# Altium schematic sheet Muller-C1(2).SchDoc
size 429 x 344 mm
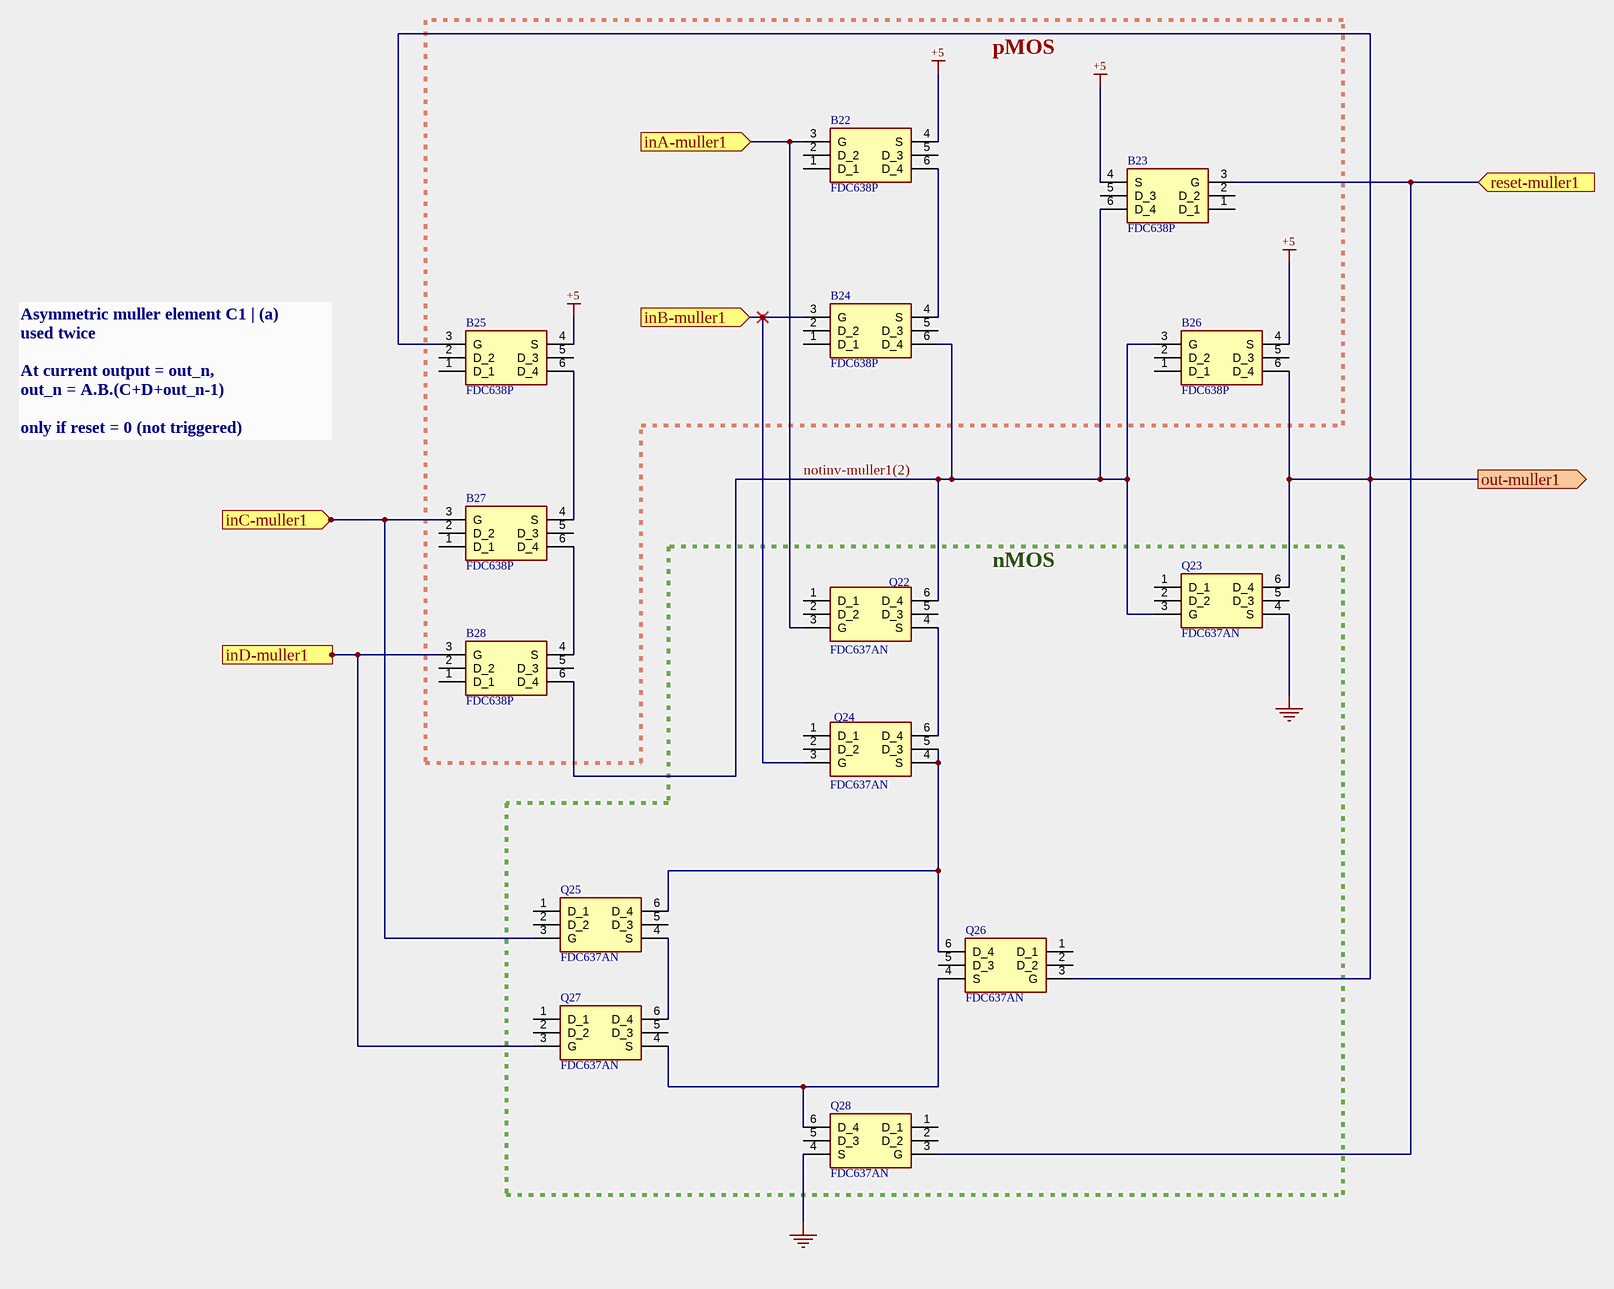
[diagram p0: Muller-C1(2).SchDoc]

## Parts
B22  FDC638P  [SOT95P275X110-6N]
B23  FDC638P  [SOT95P275X110-6N]
B24  FDC638P  [SOT95P275X110-6N]
B25  FDC638P  [SOT95P275X110-6N]
B26  FDC638P  [SOT95P275X110-6N]
B27  FDC638P  [SOT95P275X110-6N]
B28  FDC638P  [SOT95P275X110-6N]
Q22  FDC637AN  [SOT95P275X110-6N]
Q23  FDC637AN  [SOT95P275X110-6N]
Q24  FDC637AN  [SOT95P275X110-6N]
Q25  FDC637AN  [SOT95P275X110-6N]
Q26  FDC637AN  [SOT95P275X110-6N]
Q27  FDC637AN  [SOT95P275X110-6N]
Q28  FDC637AN  [SOT95P275X110-6N]

## Blocks framed on the sheet
pMOS: B22-B28
nMOS: Q22-Q28

## Ports
inA-muller1 (in), inB-muller1 (in), inC-muller1 (in), inD-muller1 (in), out-muller1 (out), reset-muller1 (in)

## Nets
+5: B22.4(S) B23.4(S) B25.4(S) B26.4(S)
GND: Q23.4(S) Q28.4(S)
inA-muller1: B22.3(G) Q22.3(G) ; port inA-muller1
inB-muller1: B24.3(G) Q24.3(G) ; port inB-muller1
inC-muller1: B27.3(G) Q25.3(G) ; port inC-muller1
inD-muller1: B28.3(G) Q27.3(G) ; port inD-muller1
notinv-muller1(2): B23.6(D_4) B24.6(D_4) B26.3(G) B28.6(D_4) Q22.6(D_4) Q23.3(G)
out-muller1: B25.3(G) B26.6(D_4) Q23.6(D_4) Q26.3(G) ; port out-muller1
reset-muller1: B23.3(G) Q28.3(G) ; port reset-muller1
NetB22_6: B22.6(D_4) B24.4(S)
NetB25_6: B25.6(D_4) B27.4(S)
NetB27_6: B27.6(D_4) B28.4(S)
NetQ22_4: Q22.4(S) Q24.6(D_4)
NetQ24_4: Q24.4(S) Q24.5(D_3) Q25.6(D_4) Q26.6(D_4)
NetQ25_4: Q25.4(S) Q27.6(D_4)
NetQ26_4: Q26.4(S) Q27.4(S) Q28.6(D_4)

Not connected (* = marked no-connect by the designer): B22 1(D_1) 2(D_2) 5(D_3); B23 1(D_1) 2(D_2) 5(D_3); B24 1(D_1) 2(D_2) 5(D_3); B25 1(D_1) 2(D_2) 5(D_3); B26 1(D_1) 2(D_2) 5(D_3); B27 1(D_1) 2(D_2) 5(D_3); B28 1(D_1) 2(D_2) 5(D_3); Q22 1(D_1) 2(D_2) 5(D_3); Q23 1(D_1) 2(D_2) 5(D_3); Q24 1(D_1) 2(D_2); Q25 1(D_1) 2(D_2) 5(D_3); Q26 1(D_1) 2(D_2) 5(D_3); Q27 1(D_1) 2(D_2) 5(D_3); Q28 1(D_1) 2(D_2) 5(D_3)

## Notes on the sheet
- Asymmetric muller element C1 | (a)
  used twice
  At current output = out_n,
  out_n = A.B.(C+D+out_n-1)
  only if reset = 0 (not triggered)

## Library data of the parts
B22-B28 = CMP-007-000000-1: Low gate charge (10 nC typical); Manufacturer_Name: onsemi; Geometry.Height: 1.1mm; Datasheet Link: https://www.onsemi.com/pub/Collateral/FDC638P-D.PDF; Arrow Price/Stock: *; Design Item ID: FDC638P; Mouser Part Number: 512-FDC638P; Manufacturer_Part_Number: FDC638P; Mouser Price/Stock: https://www.mouser.co.uk/ProductDetail/onsemi-Fairchild/FDC638P?qs=FOlmdCx%252BAA16kOuf%252Brkheg%3D%3D; Source: FDC638P.SchLib; Arrow Part Number: *
Q22-Q28 = CMP-005-000000-4: Low gate charge (10.5nC typical).; Manufacturer_Name: onsemi; Geometry.Height: 1.1mm; Mouser Part Number: 512-FDC637AN; Source: FDC637AN.SchLib; Arrow Part Number: FDC637AN; Datasheet Link: https://www.onsemi.com/pub/Collateral/FDC637AN-D.PDF; Arrow Price/Stock: https://www.arrow.com/en/products/fdc637an/on-semiconductor?region=nac; Manufacturer_Part_Number: FDC637AN; Mouser Price/Stock: https://www.mouser.co.uk/ProductDetail/ON-Semiconductor-Fairchild/FDC637AN?qs=utFvTgNEmG6iAEUdTAueXw%3D%3D; Design Item ID: FDC637AN